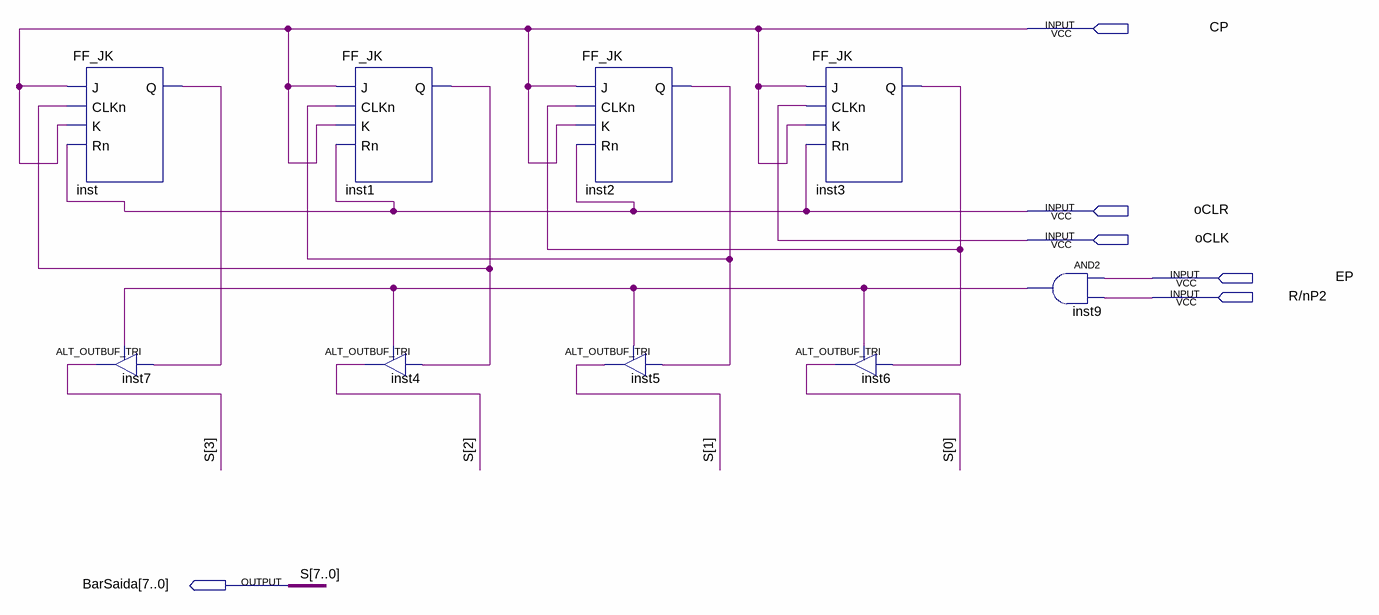
[diagram p0: schematic sheet]
// Quartus schematic Contador_Binario.bdf as structural Verilog: 9 symbols, 6 pins
module Contador_Binario (
  input  CP,
  input  oCLR,
  input  oCLK,
  input  EP,
  input  \R/nP2 ,
  output [7:0] BarSaida
);

  wire inst1_q, inst2_q, inst3_q, inst9_out, inst_q;

  FF_JK inst (.J(CP), .CLKn(inst1_q), .K(CP), .Rn(oCLR), .Q(inst_q));
  ALT_OUTBUF_TRI inst7 (.i(inst_q), .oe(inst9_out), .o(BarSaida[3]));
  FF_JK inst1 (.J(CP), .CLKn(inst2_q), .K(CP), .Rn(oCLR), .Q(inst1_q));
  ALT_OUTBUF_TRI inst4 (.i(inst1_q), .oe(inst9_out), .o(BarSaida[2]));
  FF_JK inst2 (.J(CP), .CLKn(inst3_q), .K(CP), .Rn(oCLR), .Q(inst2_q));
  ALT_OUTBUF_TRI inst5 (.i(inst2_q), .oe(inst9_out), .o(BarSaida[1]));
  FF_JK inst3 (.J(CP), .CLKn(oCLK), .K(CP), .Rn(oCLR), .Q(inst3_q));
  ALT_OUTBUF_TRI inst6 (.i(inst3_q), .oe(inst9_out), .o(BarSaida[0]));
  and inst9 (inst9_out, EP, \R/nP2 );

  // Other names for the same wires on the sheet: S[7:0] = BarSaida
endmodule
